# EAGLE design PAPx2-4 (EAGLE 7.2.0)
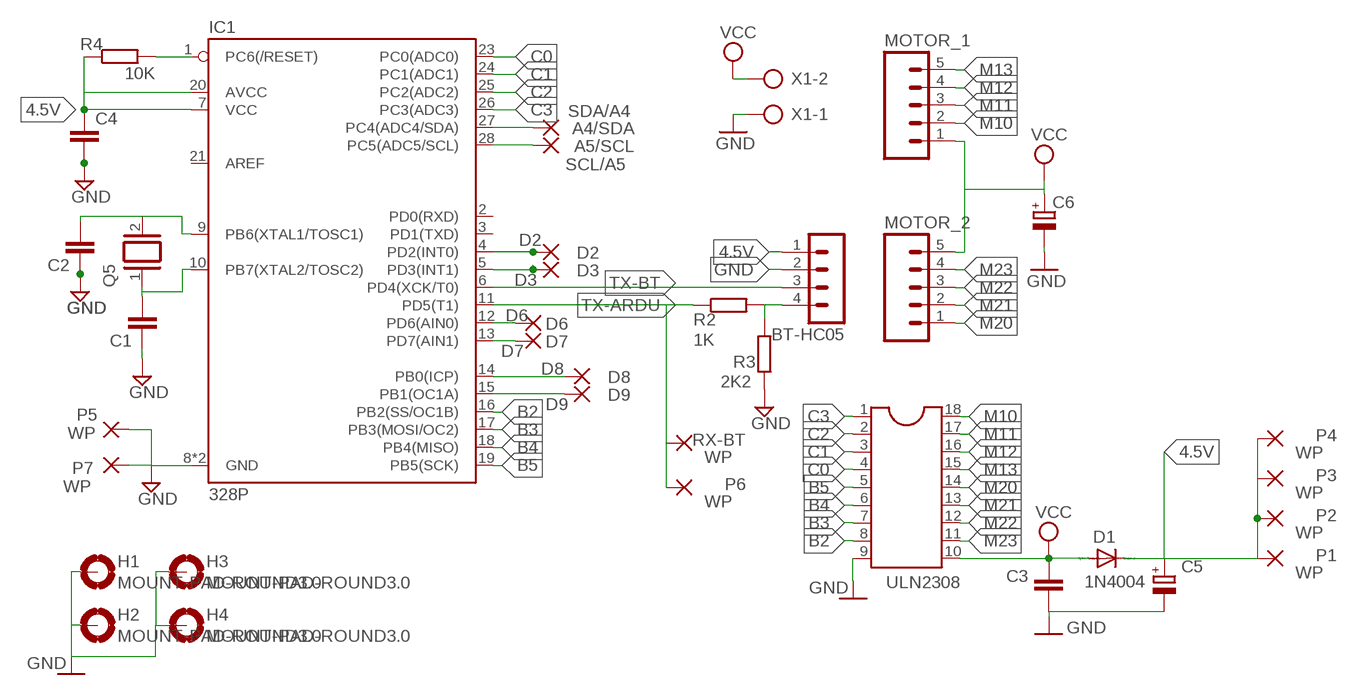
[diagram p0: schematic, sheet 1]

## Parts
BT-HC05  MA04-1  [MA04-1]
C1  C-EU025-025X050  [C025-025X050]
C2  C-EU025-025X050  [C025-025X050]
C3  C-EU050-025X075  [C050-025X075]
C4  C-EU050-025X075  [C050-025X075]
C5  CPOL-EUE2.5-5  [E2,5-5]
C6  CPOL-EUE2.5-5  [E2,5-5]
D1  1N4004  [DO41-10]
D2  D2  WIREPAD1,6/0,8  [1,6/0,8]
D3  D3  WIREPAD1,6/0,8  [1,6/0,8]
D6  D6  WIREPAD1,6/0,8  [1,6/0,8]
D7  D7  WIREPAD1,6/0,8  [1,6/0,8]
D8  D8  WIREPAD1,6/0,8  [1,6/0,8]
D9  D9  WIREPAD1,6/0,8  [1,6/0,8]
H1  MOUNT-PAD-ROUND3.0  [3,0-PAD]
H2  MOUNT-PAD-ROUND3.0  [3,0-PAD]
H3  MOUNT-PAD-ROUND3.0  [3,0-PAD]
H4  MOUNT-PAD-ROUND3.0  [3,0-PAD]
IC1  328P  ATMEGA328P  [DIP28]
MOTOR_1  M05  [05P]
MOTOR_2  M05  [05P]
P1  WP  WIREPAD1,6/0,8  [1,6/0,8]
P2  WP  WIREPAD1,6/0,8  [1,6/0,8]
P3  WP  WIREPAD1,6/0,8  [1,6/0,8]
P4  WP  WIREPAD1,6/0,8  [1,6/0,8]
P5  WP  WIREPAD1,6/0,8  [1,6/0,8]
P6  WP  WIREPAD1,6/0,8  [1,6/0,8]
P7  WP  WIREPAD1,6/0,8  [1,6/0,8]
Q5  XTAL/S  [QS]
R2  1K  R-EU_0204/7  [0204/7]
R3  2K2  R-EU_0204/7  [0204/7]
R4  10K  R-EU_0204/7  [0204/7]
RX-BT  WP  WIREPAD1,6/0,8  [1,6/0,8]
SCL/A5  A5/SCL  WIREPAD1,6/0,8  [1,6/0,8]
SDA/A4  A4/SDA  WIREPAD1,6/0,8  [1,6/0,8]
ULN2308  DIL18  [DIL18]
X1  AK500/2  [AK500/2]

## Nets
4.5V: BT-HC05.1 C4.1 C5.+ D1.C IC1.7(VCC) IC1.20(AVCC) P1.1(P) P2.1(P) P3.1(P) P4.1(P) R4.1
B2: IC1.16(PB2(SS/OC1B)) ULN2308.8
B3: IC1.17(PB3(MOSI/OC2)) ULN2308.7
B4: IC1.18(PB4(MISO)) ULN2308.6
B5: IC1.19(PB5(SCK)) ULN2308.5
C0: IC1.23(PC0(ADC0)) ULN2308.4
C1: IC1.24(PC1(ADC1)) ULN2308.3
C2: IC1.25(PC2(ADC2)) ULN2308.2
C3: IC1.26(PC3(ADC3)) ULN2308.1
GND: BT-HC05.2 C1.1 C2.1 C3.2 C4.2 C5.- C6.- H1.B3,0(MOUNT) H2.B3,0(MOUNT) H3.B3,0(MOUNT) H4.B3,0(MOUNT) IC1.8(GND) IC1.22(GND) P5.1(P) P7.1(P) R3.1 ULN2308.9 X1.1
M10: MOTOR_1.2 ULN2308.18
M11: MOTOR_1.3 ULN2308.17
M12: MOTOR_1.4 ULN2308.16
M13: MOTOR_1.5 ULN2308.15
M20: MOTOR_2.1 ULN2308.14
M21: MOTOR_2.2 ULN2308.13
M22: MOTOR_2.3 ULN2308.12
M23: MOTOR_2.4 ULN2308.11
N$1: BT-HC05.4 R2.2 R3.2
N$2: C1.2 IC1.10(PB7(XTAL2/TOSC2)) Q5.1
N$3: C2.2 IC1.9(PB6(XTAL1/TOSC1)) Q5.2
N$4: IC1.1(PC6(/RESET)) R4.2
N$5: D9.1(P) IC1.15(PB1(OC1A))
N$6: D8.1(P) IC1.14(PB0(ICP))
N$9: D2.1(P) IC1.4(PD2(INT0))
N$10: D3.1(P) IC1.5(PD3(INT1))
N$11: IC1.27(PC4(ADC4/SDA)) SDA/A4.1(P)
N$12: IC1.28(PC5(ADC5/SCL)) SCL/A5.1(P)
N$13: D6.1(P) IC1.12(PD6(AIN0))
N$14: D7.1(P) IC1.13(PD7(AIN1))
TX-ARDU: IC1.11(PD5(T1)) P6.1(P) R2.1 RX-BT.1(P)
TX-BT: BT-HC05.3 IC1.6(PD4(XCK/T0))
VCC: C3.1 C6.+ D1.A MOTOR_1.1 MOTOR_2.5 ULN2308.10 X1.2
Unconnected: IC1.2(PD0(RXD)) IC1.3(PD1(TXD)) IC1.21(AREF)

## Library data of the parts
BT-HC05 = con-lstb:MA04-1: PIN HEADER; OC_FARNELL: unknown; OC_NEWARK: unknown
C1-C4 = rcl:C-EU: CAPACITOR, European symbol
C5 C6 = resistor:CPOL-EU: POLARIZED CAPACITOR, European symbol
D1 = diode:1N4004: DIODE general purpose rectifier, 1 A
D2 D3 D6-D9 P1-P7 RX-BT SCL/A5 SDA/A4 = wirepad:WIREPAD: Wire PAD connect wire on PCB
H1-H4 = holes:MOUNT-PAD-ROUND: MOUNTING PAD, round
IC1 = treser_lib:ATMEGA328P: Atmel ATMEGA328P 32kb flash, 1k EEPROM, 2k SRAM; PROD_ID: IC-09136
MOTOR_1 MOTOR_2 = con-amp-quick:M05: AMP QUICK CONNECTOR; OC_FARNELL: unknown; OC_NEWARK: unknown
Q5 = special:XTAL/S: CRYSTAL
R2-R4 = resistor:R-EU_: RESISTOR, European symbol
ULN2308 = ic-package:DIL18: Dual In Line / Socket
X1 = con-ptr500:AK500/2: CONNECTOR; OC_FARNELL: unknown; OC_NEWARK: unknown

## Board
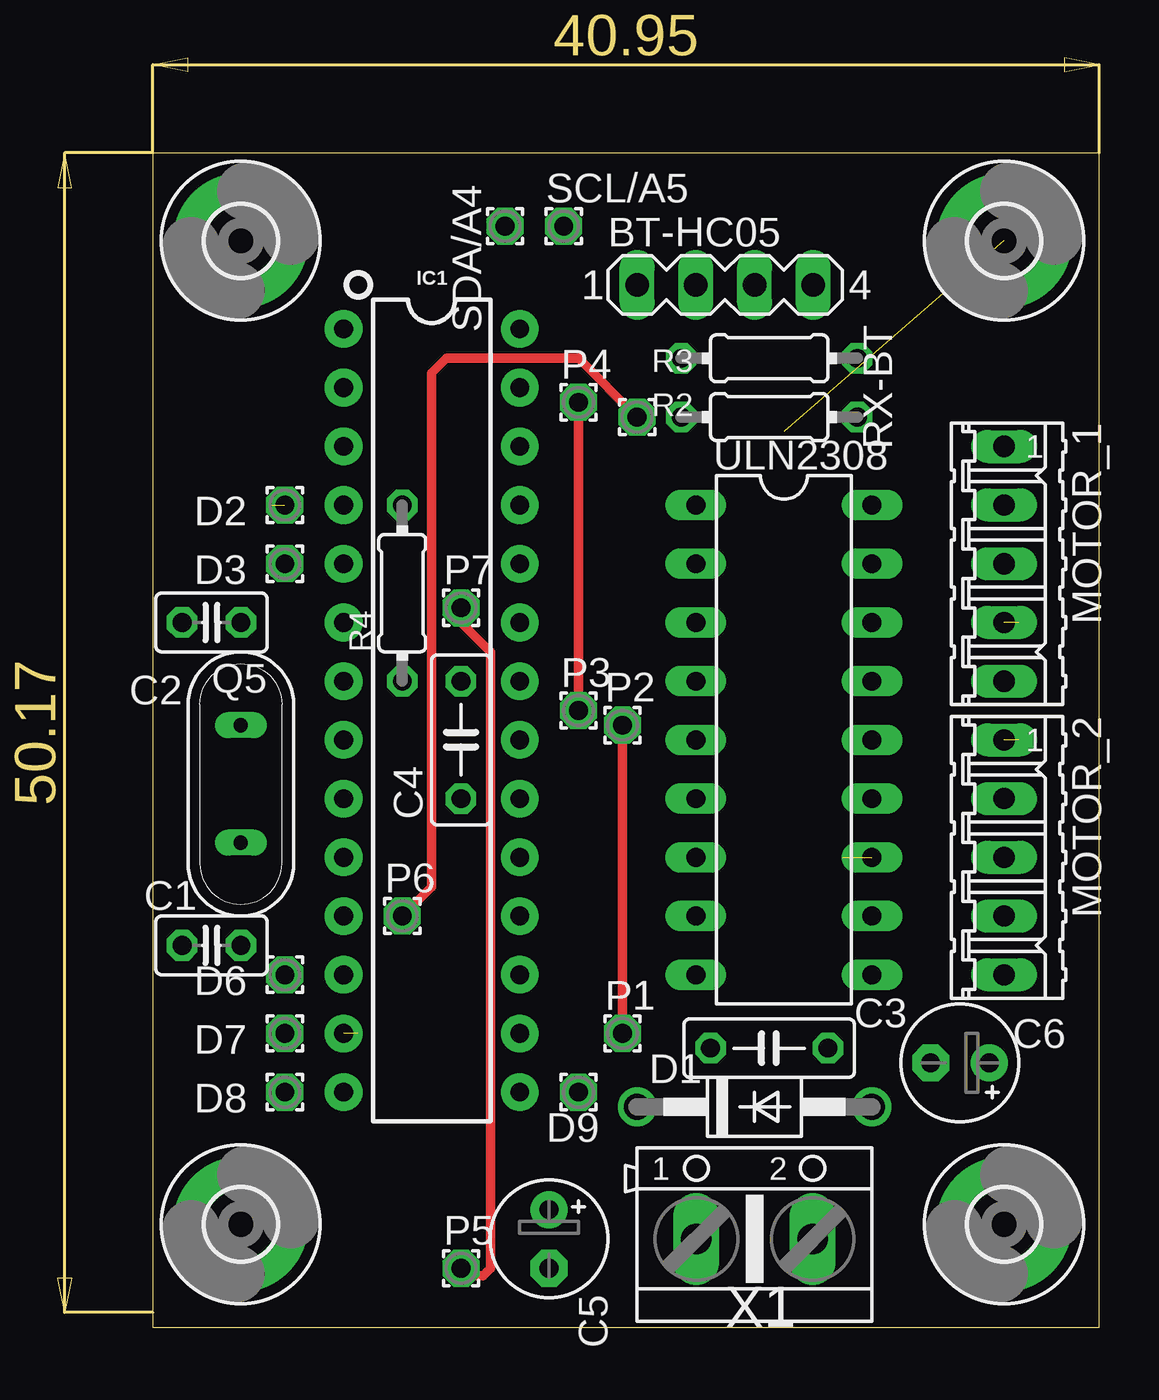
[diagram p1: board, top side]
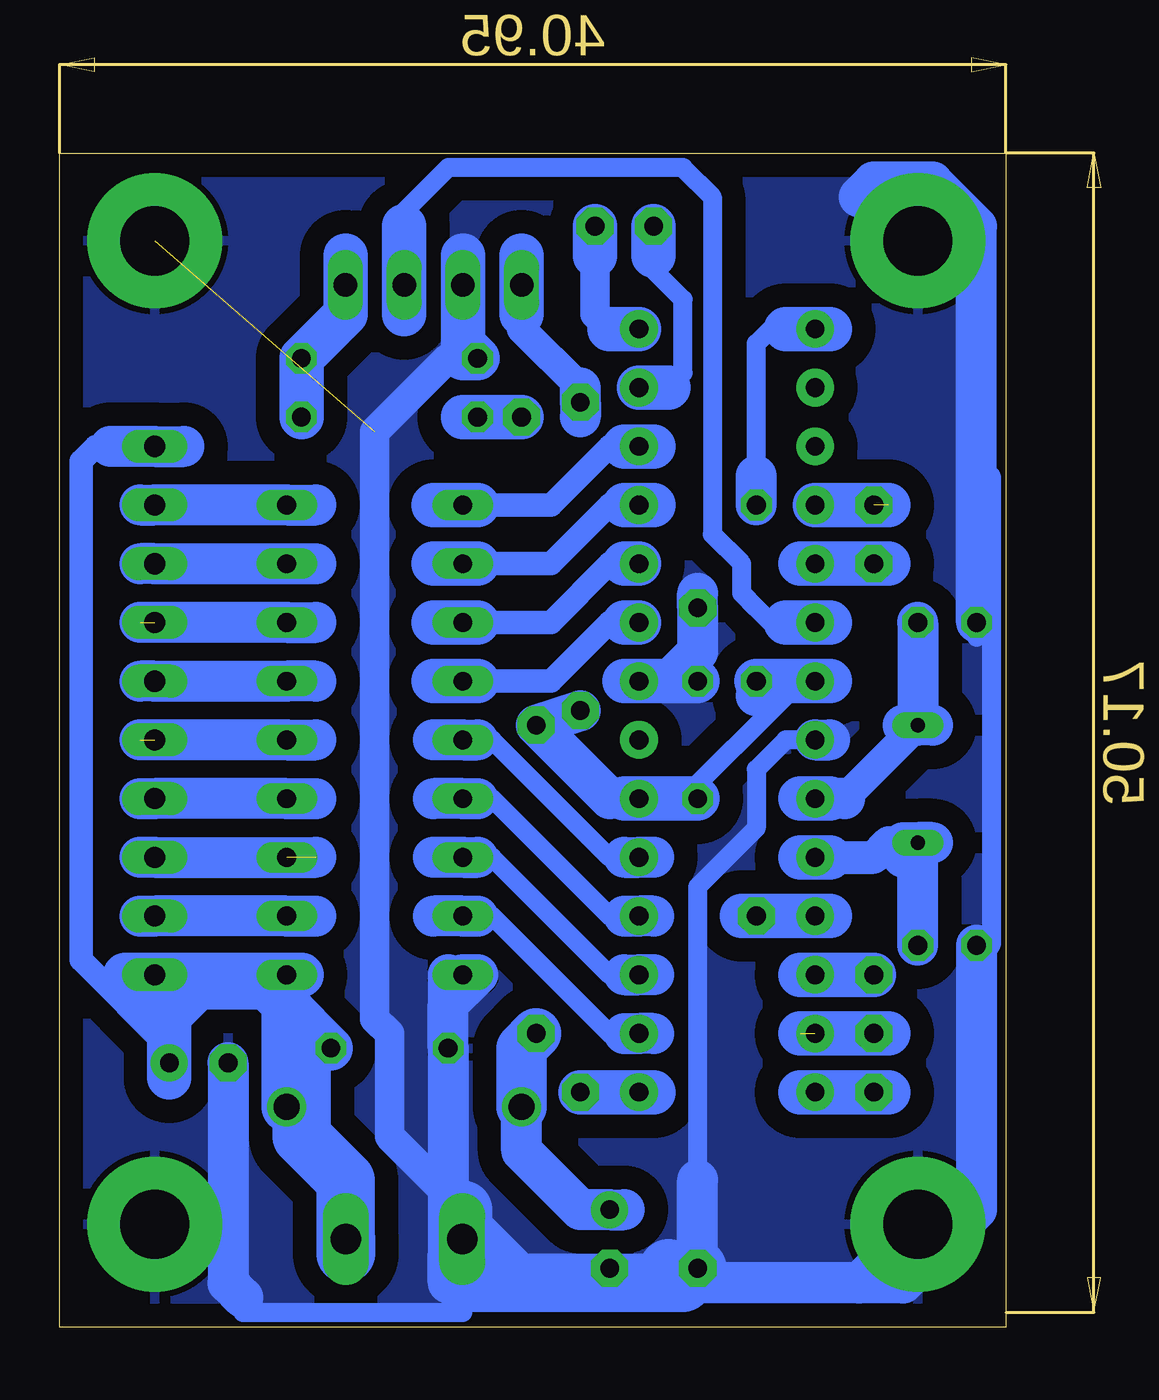
[diagram p2: board, bottom side, seen from below]

Size 40.95 x 50.79 mm. Coordinates in mm from the lower left corner, seen from the top.
Outline: 0,0 40.95,0 40.95,50.79 0,50.79 0,0
Copper layers (1*16): Top 0.035mm / dielectric 1.5mm / Bottom 0.035mm
Design rules "default": minimum track width 10mil, minimum drill 24mil, track to track 8mil, track to pad 8mil, pad to pad 8mil, via to via 8mil, smd to smd 8mil, copper to edge 40mil, drill to drill 8mil, minimum pad ring 10mil, minimum via ring 8mil, stop-mask expansion 4mil, vias tented up to drill 0mil, thermal gap 10mil

### Footprints (pad centres in the part's own frame; a part is rotated, then mirrored left to right if it is on the bottom)
MA04-1 = drill 1.016 long: 1 -3.81,0; 2 -1.27,0; 3 1.27,0; 4 3.81,0
C025-025X050 = drill 0.813 octagon: 1 -1.27,0; 2 1.27,0
C050-025X075 = drill 0.813 octagon: 1 -2.54,0; 2 2.54,0
E2,5-5 = drill 0.813 pad 1.6: + -1.27,0 | drill 0.813 pad 1.6 octagon: - 1.27,0
DO41-10 = drill 1.118: A 5.08,0; C -5.08,0
1,6/0,8 = drill 0.813 pad 1.6 octagon: 1 0,0
3,0-PAD = drill 3 pad 5.842: B3,0 0,0
DIP28 = drill 0.813 pad 1.626: 1 -16.51,-3.81; 2 -13.97,-3.81; 3 -11.43,-3.81; 4 -8.89,-3.81; 5 -6.35,-3.81; 6 -3.81,-3.81; 7 -1.27,-3.81; 8 1.27,-3.81; 9 3.81,-3.81; 10 6.35,-3.81; 11 8.89,-3.81; 12 11.43,-3.81; 13 13.97,-3.81; 14 16.51,-3.81; 15 16.51,3.81; 16 13.97,3.81; 17 11.43,3.81; 18 8.89,3.81; 19 6.35,3.81; 20 3.81,3.81; 21 1.27,3.81; 22 -1.27,3.81; 23 -3.81,3.81; 24 -6.35,3.81; 25 -8.89,3.81; 26 -11.43,3.81; 27 -13.97,3.81; 28 -16.51,3.81
05P = drill 0.914 long: 1 -5.08,0; 2 -2.54,0; 3 0,0; 4 2.54,0; 5 5.08,0
QS = drill 0.61 long: 1 -2.54,0; 2 2.54,0
0204/7 = drill 0.813 octagon: 1 -3.81,0; 2 3.81,0
DIL18 = drill 0.813 long: 1 -10.16,-3.81; 2 -7.62,-3.81; 3 -5.08,-3.81; 4 -2.54,-3.81; 5 0,-3.81; 6 2.54,-3.81; 7 5.08,-3.81; 8 7.62,-3.81; 9 10.16,-3.81; 10 10.16,3.81; 11 7.62,3.81; 12 5.08,3.81; 13 2.54,3.81; 14 0,3.81; 15 -2.54,3.81; 16 -5.08,3.81; 17 -7.62,3.81; 18 -10.16,3.81
AK500/2 = drill 1.321 long: 1 -2.515,0; 2 2.515,0

### Placement (x,y rotation side)
BT-HC05  24.77,45.09 0 top
C1  2.54,16.51 0 top
C2  2.54,30.48 0 top
C3  26.67,12.06 180 top
C4  13.34,25.4 90 top
C5  17.15,3.81 270 top
C6  34.92,11.43 180 top
D1  26.03,9.53 0 top
D2  5.71,35.56 0 top
D3  5.71,33.02 0 top
D6  5.71,15.24 0 top
D7  5.71,12.7 0 top
D8  5.71,10.16 0 top
D9  18.41,10.16 0 top
H1  3.81,4.45 0 top
H2  36.83,4.45 0 top
H3  36.83,46.99 0 top
H4  3.81,46.99 0 top
IC1  12.06,26.67 270 top
MOTOR_1  36.83,33.02 270 top
MOTOR_2  36.83,20.32 270 top
P1  20.32,12.7 0 top
P2  20.32,26.03 0 top
P3  18.41,26.67 0 top
P4  18.41,40.01 0 top
P5  13.34,2.54 0 top
P6  10.79,17.78 0 top
P7  13.34,31.12 0 top
Q5  3.81,23.49 90 top
R2  26.67,39.37 0 top
R3  26.67,41.91 0 top
R4  10.79,31.75 90 top
RX-BT  20.95,39.37 0 top
SCL/A5  17.78,47.62 0 top
SDA/A4  15.24,47.62 0 top
ULN2308  27.3,25.4 270 top
X1  26.03,3.81 0 top

### Tracks (layer width: path | path; a pad name or v marks a point on that pad's centre or on a via)
4.5V
  Top 0.406: P1.1 P2.1 | P3.1 P4.1
  Bottom 0.813: 10.79,27.3 9.52,27.3 13.97,22.86
  Bottom 1.27: 18.41,40.64 20.95,43.18 20.95,43.82
  Bottom 1.778: R4.1 10.79,27.3 | 16.51,22.86 17.15,22.86 P2.1 P3.1 | 18.41,39.37 P4.1 18.41,40.64 | 16.51,5.08 C5.+ 18.41,5.08 20.95,7.62 D1.C
  Bottom 1.93: 16.51,22.86 IC1.20 13.97,22.86 C4.1 | 20.95,46.36 BT-HC05.1 20.95,43.82 | R4.1 IC1.7 7.62,27.94
  Bottom 2.184: P1.1 20.95,12.06 D1.C
B2
  Bottom 0.813: 22.86,17.78 22.23,17.78 17.15,12.7 16.51,12.7
  Bottom 1.778: 24.77,17.78 ULN2308.8 22.86,17.78 | 16.51,12.7 IC1.16 15.24,12.7
B3
  Bottom 0.813: 22.86,20.32 22.23,20.32 17.15,15.24 16.51,15.24
  Bottom 1.778: 24.77,20.32 ULN2308.7 22.86,20.32 | 16.51,15.24 IC1.17 15.24,15.24
B4
  Bottom 0.813: 22.86,22.86 22.23,22.86 17.15,17.78 16.51,17.78
  Bottom 1.778: 24.77,22.86 ULN2308.6 22.86,22.86 | 16.51,17.78 IC1.18 15.24,17.78
B5
  Bottom 0.813: 22.86,25.4 22.23,25.4 17.15,20.32 16.51,20.32
  Bottom 1.778: 24.77,25.4 ULN2308.5 22.86,25.4 | 16.51,20.32 IC1.19 15.24,20.32
C0
  Bottom 1.016: 16.51,30.48 17.15,30.48 19.69,27.94 22.86,27.94
  Bottom 1.93: IC1.23 16.51,30.48 | 24.77,27.94 ULN2308.4 22.86,27.94
C1
  Bottom 1.016: 22.86,30.48 19.69,30.48 17.15,33.02 16.51,33.02
  Bottom 1.93: IC1.24 16.51,33.02 | 24.77,30.48 ULN2308.3 22.86,30.48
C2
  Bottom 1.016: 22.86,33.02 19.69,33.02 17.15,35.56 16.51,35.56
  Bottom 1.93: 15.24,35.56 IC1.25 16.51,35.56 | 24.77,33.02 ULN2308.2 22.86,33.02
C3
  Bottom 1.016: 22.86,35.56 19.69,35.56 17.15,38.1 16.51,38.1
  Bottom 1.93: 24.77,35.56 ULN2308.1 22.86,35.56 | 16.51,38.1 IC1.26 15.24,38.1
GND  (1 unrouted)
  Top 0.406: P7.1 13.34,30.48 14.6,29.21 14.6,2.54 14.29,2.22 13.65,2.22 P5.1
  Bottom 0.813: 33.02,1.27 33.02,0.63 23.49,0.63 23.49,1.91 | IC1.8 9.52,25.4 10.79,24.13 10.79,21.59 13.34,19.05 13.34,6.35 | C2.1 1.27,29.84 | 1.27,15.87 0.63,16.51 0.63,36.83 1.27,36.2
  Bottom 1.27: R3.1 24.13,41.91 27.3,38.73 27.3,13.33 26.67,12.7 26.67,8.26 20.32,1.91
  Bottom 1.778: 24.13,13.97 C3.2 24.13,3.2 | 24.13,15.24 24.13,13.97 | 24.13,13.97 22.86,15.24 ULN2308.9 | 24.13,1.91 24.13,3.2 | 24.13,3.2 X1.1 | C6.- 33.66,1.91 33.02,1.27 | 13.34,31.75 P7.1 13.34,29.21 14.6,27.94 | C2.1 1.27,36.2 1.27,47.62 3.18,49.53 5.71,49.53 6.35,48.9 | IC1.8 7.62,25.4 | P5.1 13.34,6.35 | H1.B3,0 6.35,1.91 | 6.35,1.91 13.97,1.91 | C1.1 1.27,15.87 1.27,5.08 4.45,1.91 6.35,1.91
  Bottom 1.93: 16.51,27.94 IC1.22 14.6,27.94 C4.2 | 23.49,41.91 R3.1 23.49,42.55 BT-HC05.2 23.49,46.36
  Bottom 2.54: X1.1 23.52,3.2 23.49,3.18 | 23.49,3.18 23.49,5.08 | 23.49,3.18 23.49,1.91 20.32,1.91 13.97,1.91 | 13.97,1.91 P5.1 | 13.97,1.91 14.6,2.54
  pour Bottom (isolate 1.016): 0,0 41.27,0 41.27,0.63 41.27,50.8 0,50.8
M10
  Bottom 1.778: 29.84,35.56 ULN2308.18 MOTOR_1.2 37.46,35.56
M11
  Bottom 1.778: 37.46,33.02 MOTOR_1.3 ULN2308.17 30.48,33.02 29.84,33.02
M12  (1 unrouted)
  Bottom 1.778: 29.84,30.48 ULN2308.16 37.46,30.48
M13
  Bottom 1.778: 37.46,27.94 MOTOR_1.5 ULN2308.15 29.84,27.94
M20  (1 unrouted)
  Bottom 1.778: 29.84,25.4 ULN2308.14 37.46,25.4
M21
  Bottom 1.778: 29.84,22.86 ULN2308.13 MOTOR_2.2 37.46,22.86
M22  (1 unrouted)
  Bottom 1.778: 37.46,20.32 MOTOR_2.3 29.84,20.32
M23
  Bottom 1.778: 29.84,17.78 ULN2308.11 MOTOR_2.4 37.46,17.78
N$1
  Bottom 1.93: R2.2 R3.2 28.58,43.82 BT-HC05.4 28.58,46.36
N$2
  Bottom 1.422: 7.62,20.32 5.71,20.32 5.08,20.95 4.45,20.95
  Bottom 1.778: 4.45,20.95 Q5.1 | 3.18,20.95 Q5.1 | 4.45,20.32 Q5.1 | C1.2 Q5.1
  Bottom 1.93: 8.89,20.32 IC1.10 7.62,20.32
N$3
  Bottom 1.27: 6.98,22.86 Q5.2
  Bottom 1.778: 4.45,26.03 Q5.2 | 3.18,26.03 Q5.2 | 6.98,22.86 7.62,22.86 | C2.2 Q5.2
  Bottom 1.93: 7.62,22.86 IC1.9 8.89,22.86
N$4
  Bottom 0.813: 10.79,36.83 10.79,42.55 10.16,43.18 9.52,43.18
  Bottom 1.778: R4.2 10.79,36.83
  Bottom 1.93: 9.52,43.18 IC1.1 7.62,43.18
N$5
  Bottom 1.93: D9.1 IC1.15 15.24,10.16
N$6
  Bottom 1.93: 8.89,10.16 IC1.14 D8.1 5.08,10.16
N$9  (1 unrouted)
  Bottom 1.93: IC1.4 5.08,35.56
N$10
  Bottom 1.93: 8.89,33.02 IC1.5 D3.1 5.08,33.02
N$11
  Bottom 0.813: 14.6,40.64 13.97,41.27 13.97,44.45 15.24,45.72 15.24,46.36
  Bottom 1.93: IC1.27 14.6,40.64 | 15.24,46.36 SDA/A4.1
N$12
  Bottom 1.27: 17.78,46.36 17.78,43.82 17.15,43.18
  Bottom 1.93: SCL/A5.1 17.78,46.36 | 17.15,43.18 IC1.28
N$13
  Bottom 1.93: 8.89,15.24 IC1.12 D6.1
N$14  (1 unrouted)
  Bottom 1.93: 5.08,12.7 D7.1 8.89,12.7
TX-ARDU
  Top 0.406: RX-BT.1 18.41,41.91 12.7,41.91 12.06,41.27 12.06,19.05 P6.1
  Bottom 1.93: 7.62,17.78 IC1.11 P6.1 11.43,17.78 | RX-BT.1 R2.1 23.49,39.37
TX-BT
  Bottom 0.813: 26.03,47.62 26.03,48.26 24.13,50.16 13.97,50.16 12.7,48.9 12.7,34.29 11.43,33.02 11.43,31.75 10.79,31.12 10.16,30.48 9.52,30.48
  Bottom 1.93: 26.03,43.82 BT-HC05.3 26.03,47.62 | 7.62,30.48 IC1.6 9.52,30.48
VCC
  Bottom 1.016: 38.73,38.1 39.37,38.1 40.01,37.47 40.01,15.87 36.2,12.06
  Bottom 1.778: 31.75,14.6 34.92,14.6 36.2,13.33 38.1,15.24 | 30.48,12.7 29.84,12.06 C3.1 | 35.56,38.1 MOTOR_1.1 38.73,38.1
  Bottom 1.93: 36.2,10.79 C6.+ 36.2,12.06 36.2,13.33 36.2,15.24 | 38.1,15.24 MOTOR_2.5 ULN2308.10 | 30.48,15.24 ULN2308.10 | ULN2308.10 31.12,13.97 C3.1
  Bottom 2.184: D1.A 31.12,13.97 31.75,14.6
  Bottom 2.54: X1.2 28.55,3.2 28.58,3.18 28.58,6.35 30.48,8.26 30.48,12.7